# EAGLE design Maple_Mini_jr1 (EAGLE 7.6.0)
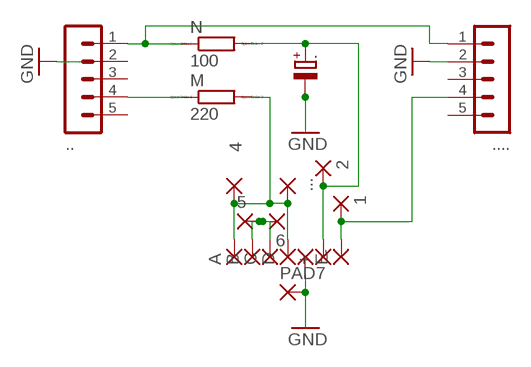
[diagram p0: schematic, sheet 1]

## Parts
1  SMD2  [SMD1,27-2,54]
2  SMD2  [SMD1,27-2,54]
4  SMD2  [SMD1,27-2,54]
5  SMD2  [SMD1,27-2,54]
6  SMD2  [SMD1,27-2,54]
+  SMD2  [SMD1,27-2,54]
-  SMD2  [SMD1,27-2,54]
.  CPOL-EUE1.8-4  [E1,8-4]
..  MA05-1  [MA05-1]
...  SMD2  [SMD1,27-2,54]
....  MA05-1  [MA05-1]
A  SMD2  [SMD1,27-2,54]
B  SMD2  [SMD1,27-2,54]
C  SMD2  [SMD1,27-2,54]
D  SMD2  [SMD1,27-2,54]
E  SMD2  [SMD1,27-2,54]
M  220  R0204/7  [0204/7]
N  100  R0204/7  [0204/7]
PAD7  SMD2  [SMD1,27-2,54]

## Nets
GND: -.1(P) ..- .....2 PAD7.1(P)
N$1: ...1 .....1 N.1
N$2: ...4 M.1
N$3: 4.1(P) ....1(P) A.1(P) D.1(P) M.2
N$4: 5.1(P) 6.1(P) B.1(P) C.1(P)
N$5: 2.1(P) +.1(P) ..+ N.2
N$6: 1.1(P) .....4 E.1(P)
Unconnected: ...2 ...3 ...5 .....3 .....5

## Library data of the parts
1 2 4-6 + - ... A B C D E PAD7 = wirepad:SMD2: SMD PAD
. = rcl:CPOL-EU: POLARIZED CAPACITOR, European symbol
.. .... = con-lstb:MA05-1: PIN HEADER; OC_FARNELL: unknown; OC_NEWARK: unknown
M N = eagle-ltspice:R: RESISTOR, European symbol; SPICEMODEL: NONE; SPICEPREFIX: R

## Board
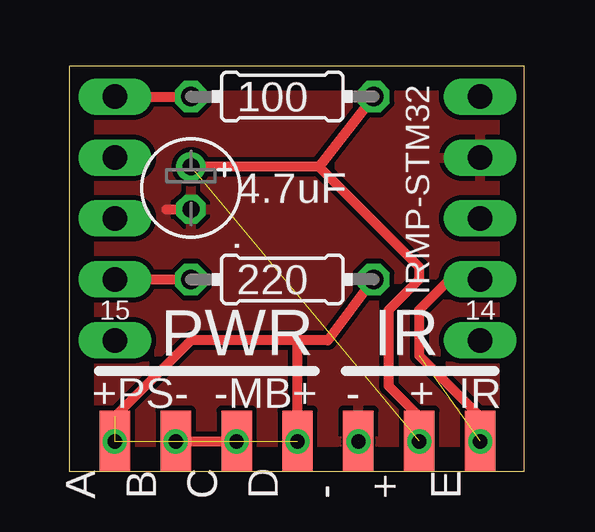
[diagram p1: board, top side]
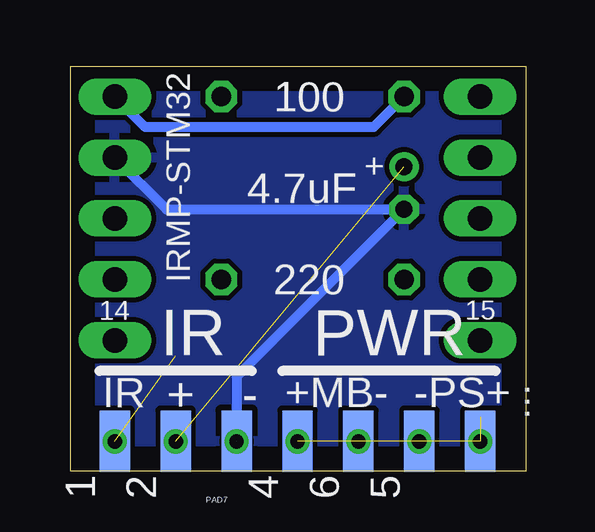
[diagram p2: board, bottom side, seen from below]

Size 18.98 x 16.87 mm. Coordinates in mm from the lower left corner, seen from the top.
Outline: 0,0 18.98,0 18.98,16.87 0,16.87 0,0
Copper layers (1*16): Top 0.035mm / dielectric 1.5mm / Bottom 0.035mm
Design rules "default": minimum track width 10mil, minimum drill 24mil, track to track 8mil, track to pad 8mil, pad to pad 8mil, via to via 8mil, smd to smd 8mil, copper to edge 40mil, drill to drill 8mil, minimum pad ring 10mil, minimum via ring 8mil, stop-mask expansion 4mil, vias tented up to drill 0mil, thermal gap 10mil

### Footprints (pad centres in the part's own frame; a part is rotated, then mirrored left to right if it is on the bottom)
SMD1,27-2,54 = smd 1.27 x 2.54: 1 0,0
E1,8-4 = drill 0.711 pad 1.168: + -0.889,0 | drill 0.711 pad 1.168 octagon: - 0.889,0
MA05-1 = drill 1.016 long: 1 -5.08,0; 2 -2.54,0; 3 0,0; 4 2.54,0; 5 5.08,0
0204/7 = drill 0.813 octagon: 1 -3.81,0; 2 3.81,0

### Placement (x,y rotation side)
1  17.14,1.25 0 bottom
2  14.61,1.25 0 bottom
4  9.53,1.25 0 bottom
5  4.45,1.25 0 bottom
6  6.99,1.25 0 bottom
+  14.61,1.25 0 top
-  12.06,1.25 0 top
.  5.08,11.8 270 top
..  1.91,10.53 270 top
...  1.91,1.25 180 bottom
....  17.14,10.53 270 top
A  1.91,1.25 0 top
B  4.45,1.25 0 top
C  6.99,1.25 0 top
D  9.53,1.25 0 top
E  17.14,1.25 0 top
M  8.89,7.99 0 top
N  8.89,15.61 0 top
PAD7  12.06,1.25 0 bottom

### Tracks (layer width: path | path; a pad name or v marks a point on that pad's centre or on a via)
GND  (1 unrouted)
  Top 0.406: 4.06,10.91 ..-
  Bottom 0.406: .....2 14.99,10.91 ..- 12.06,3.93 PAD7.1
  pour Top: 0,16.88 19.05,16.88 19.05,0 0,0
  pour Bottom: 0,16.88 19.05,16.88 19.05,0 0,0
N$1
  Top 0.406: ...1 N.1
  Bottom 0.406: N.1 6.35,14.34 15.88,14.34 .....1
N$2
  Top 0.406: ...4 M.1
N$3  (via drill 0.6)  (2 unrouted)
  Top 0.406: M.2 10.79,5.45 9.53,5.45 | 9.53,5.45 5.08,5.45 1.91,2.27 v1.91,1.24 ....1 | 4.1 v9.53,1.24 9.53,5.45
N$4  (2 unrouted)
  Top 0.406: 5.1 6.1
N$5  (via drill 0.6)  (1 unrouted)
  Top 0.406: N.2 10.41,12.69 | 10.41,12.69 ..+ | 10.41,12.69 14.61,8.5 14.61,7.99 13.34,6.72 13.34,3.55 14.61,2.27 v14.61,1.24 2.1
N$6  (via drill 0.6)  (1 unrouted)
  Top 0.406: .....4 15.88,7.99 14.61,6.72 14.61,4.81 17.14,2.27 v17.14,1.24 1.1
N$7
  pour Top: 0,16.88 19.05,16.88 19.14,0 0,0
N$8  (via drill 0.6)
  other vias: 4.45,1.24
N$9  (via drill 0.6)
  other vias: 6.99,1.24
N$10  (via drill 0.6)
  other vias: 12.06,1.24

### Text on the board
tNames: 100 | 4.7uF | 220 | IRMP-STM32 | 15 | 14 | PWR | IR | +PS- | -MB+ | - | + | IR
bNames: IRMP-STM32 | 100 | + | 4.7uF | 220 | 14 | 15 | PWR | IR | -PS+ | +MB- | - | + | IR